# Vivado block design bd_4bfa, xcu50-fsvh2104-2-e, Vivado 2022.1
# (continued, part 2 of 3)
current_bd_instance /m01_nodes

# ---- hierarchy /m01_exit_pipeline ----
current_bd_instance /m01_exit_pipeline
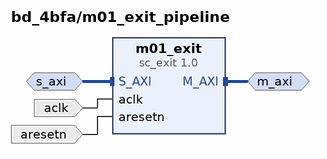
[diagram p8: block diagram inside /m01_exit_pipeline]
create_bd_intf_pin -mode Slave -vlnv xilinx.com:interface:aximm_rtl:1.0 s_axi
create_bd_intf_pin -mode Master -vlnv xilinx.com:interface:aximm_rtl:1.0 m_axi
create_bd_pin -dir I -type clk aclk
create_bd_pin -dir I -type rst aresetn

create_bd_cell -type ip -vlnv xilinx.com:ip:sc_exit:1.0 m01_exit
set_property -dict [list \
  CONFIG.ADDR_WIDTH 38 \
  CONFIG.HAS_BURST 1 \
  CONFIG.IS_CASCADED 1 \
  CONFIG.MAX_RUSER_BITS_PER_BYTE 0 \
  CONFIG.MAX_WUSER_BITS_PER_BYTE 0 \
  CONFIG.MEP_IDENTIFIER_WIDTH 1 \
  CONFIG.M_ARUSER_WIDTH 114 \
  CONFIG.M_AWUSER_WIDTH 114 \
  CONFIG.M_BUSER_WIDTH 114 \
  CONFIG.M_MAX_BURST_LENGTH 16 \
  CONFIG.M_RUSER_BITS_PER_BYTE 0 \
  CONFIG.M_RUSER_WIDTH 14 \
  CONFIG.M_WUSER_BITS_PER_BYTE 0 \
  CONFIG.M_WUSER_WIDTH 14 \
  CONFIG.NUM_MSC 5 \
  CONFIG.NUM_READ_OUTSTANDING 2 \
  CONFIG.NUM_WRITE_OUTSTANDING 2 \
  CONFIG.RDATA_WIDTH 512 \
  CONFIG.READ_WRITE_MODE READ_WRITE \
  CONFIG.SSC000_ROUTE 0b0 \
  CONFIG.SSC001_ROUTE 0b1 \
  CONFIG.SSC_ROUTE_WIDTH 1 \
  CONFIG.S_ID_WIDTH 1 \
  CONFIG.WDATA_WIDTH 512 \
] [get_bd_cells m01_exit]

# ---- hierarchy /m02_nodes ----
current_bd_instance /m02_nodes
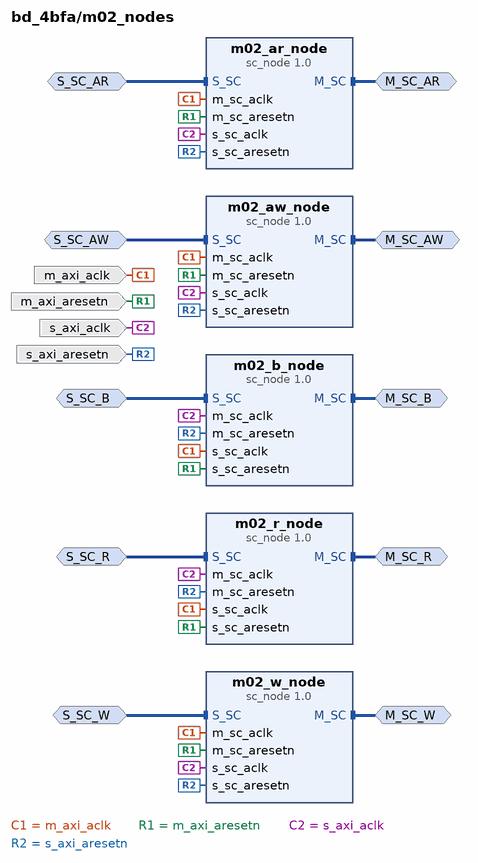
[diagram p9: block diagram inside /m02_nodes]
create_bd_intf_pin -mode Master -vlnv xilinx.com:interface:sc_rtl:1.0 M_SC_AR
create_bd_intf_pin -mode Slave -vlnv xilinx.com:interface:sc_rtl:1.0 S_SC_AR
create_bd_intf_pin -mode Master -vlnv xilinx.com:interface:sc_rtl:1.0 M_SC_R
create_bd_intf_pin -mode Slave -vlnv xilinx.com:interface:sc_rtl:1.0 S_SC_R
create_bd_intf_pin -mode Master -vlnv xilinx.com:interface:sc_rtl:1.0 M_SC_AW
create_bd_intf_pin -mode Slave -vlnv xilinx.com:interface:sc_rtl:1.0 S_SC_AW
create_bd_intf_pin -mode Master -vlnv xilinx.com:interface:sc_rtl:1.0 M_SC_W
create_bd_intf_pin -mode Slave -vlnv xilinx.com:interface:sc_rtl:1.0 S_SC_W
create_bd_intf_pin -mode Master -vlnv xilinx.com:interface:sc_rtl:1.0 M_SC_B
create_bd_intf_pin -mode Slave -vlnv xilinx.com:interface:sc_rtl:1.0 S_SC_B
create_bd_pin -dir I -type clk s_axi_aclk
create_bd_pin -dir I -type rst s_axi_aresetn
create_bd_pin -dir I -type clk m_axi_aclk
create_bd_pin -dir I -type rst m_axi_aresetn

create_bd_cell -type ip -vlnv xilinx.com:ip:sc_node:1.0 m02_ar_node
set_property -dict [list \
  CONFIG.ACLK_RELATIONSHIP 1 \
  CONFIG.ADDR_WIDTH 38 \
  CONFIG.CHANNEL 2 \
  CONFIG.ID_WIDTH 1 \
  CONFIG.M00_NUM_BYTES 64 \
  CONFIG.M01_NUM_BYTES 64 \
  CONFIG.M02_NUM_BYTES 64 \
  CONFIG.M03_NUM_BYTES 64 \
  CONFIG.M04_NUM_BYTES 64 \
  CONFIG.M05_NUM_BYTES 64 \
  CONFIG.M06_NUM_BYTES 64 \
  CONFIG.M07_NUM_BYTES 64 \
  CONFIG.M08_NUM_BYTES 64 \
  CONFIG.M09_NUM_BYTES 64 \
  CONFIG.M10_NUM_BYTES 64 \
  CONFIG.M11_NUM_BYTES 64 \
  CONFIG.M12_NUM_BYTES 64 \
  CONFIG.M13_NUM_BYTES 64 \
  CONFIG.M14_NUM_BYTES 64 \
  CONFIG.M15_NUM_BYTES 64 \
  CONFIG.MAX_PAYLD_BYTES 64 \
  CONFIG.M_SEND_PIPELINE 0 \
  CONFIG.NUM_MI 1 \
  CONFIG.NUM_OUTSTANDING 2 \
  CONFIG.NUM_SI 1 \
  CONFIG.PAYLD_WIDTH 148 \
  CONFIG.S00_NUM_BYTES 64 \
  CONFIG.S01_NUM_BYTES 64 \
  CONFIG.S02_NUM_BYTES 64 \
  CONFIG.S03_NUM_BYTES 64 \
  CONFIG.S04_NUM_BYTES 64 \
  CONFIG.S05_NUM_BYTES 64 \
  CONFIG.S06_NUM_BYTES 64 \
  CONFIG.S07_NUM_BYTES 64 \
  CONFIG.S08_NUM_BYTES 64 \
  CONFIG.S09_NUM_BYTES 64 \
  CONFIG.S10_NUM_BYTES 64 \
  CONFIG.S11_NUM_BYTES 64 \
  CONFIG.S12_NUM_BYTES 64 \
  CONFIG.S13_NUM_BYTES 64 \
  CONFIG.S14_NUM_BYTES 64 \
  CONFIG.S15_NUM_BYTES 64 \
  CONFIG.SC_ROUTE_WIDTH 5 \
  CONFIG.S_LATENCY 1 \
  CONFIG.S_PIPELINE 2 \
  CONFIG.USER_WIDTH 0 \
] [get_bd_cells m02_ar_node]
create_bd_cell -type ip -vlnv xilinx.com:ip:sc_node:1.0 m02_r_node
set_property -dict [list \
  CONFIG.ACLK_RELATIONSHIP 1 \
  CONFIG.ADDR_WIDTH 38 \
  CONFIG.CHANNEL 0 \
  CONFIG.ID_WIDTH 1 \
  CONFIG.M00_NUM_BYTES 64 \
  CONFIG.M01_NUM_BYTES 64 \
  CONFIG.M02_NUM_BYTES 64 \
  CONFIG.M03_NUM_BYTES 64 \
  CONFIG.M04_NUM_BYTES 64 \
  CONFIG.M05_NUM_BYTES 64 \
  CONFIG.M06_NUM_BYTES 64 \
  CONFIG.M07_NUM_BYTES 64 \
  CONFIG.M08_NUM_BYTES 64 \
  CONFIG.M09_NUM_BYTES 64 \
  CONFIG.M10_NUM_BYTES 64 \
  CONFIG.M11_NUM_BYTES 64 \
  CONFIG.M12_NUM_BYTES 64 \
  CONFIG.M13_NUM_BYTES 64 \
  CONFIG.M14_NUM_BYTES 64 \
  CONFIG.M15_NUM_BYTES 64 \
  CONFIG.MAX_PAYLD_BYTES 64 \
  CONFIG.M_PIPELINE 0 \
  CONFIG.NUM_MI 1 \
  CONFIG.NUM_OUTSTANDING 2 \
  CONFIG.NUM_SI 1 \
  CONFIG.PAYLD_WIDTH 531 \
  CONFIG.S00_NUM_BYTES 64 \
  CONFIG.S01_NUM_BYTES 64 \
  CONFIG.S02_NUM_BYTES 64 \
  CONFIG.S03_NUM_BYTES 64 \
  CONFIG.S04_NUM_BYTES 64 \
  CONFIG.S05_NUM_BYTES 64 \
  CONFIG.S06_NUM_BYTES 64 \
  CONFIG.S07_NUM_BYTES 64 \
  CONFIG.S08_NUM_BYTES 64 \
  CONFIG.S09_NUM_BYTES 64 \
  CONFIG.S10_NUM_BYTES 64 \
  CONFIG.S11_NUM_BYTES 64 \
  CONFIG.S12_NUM_BYTES 64 \
  CONFIG.S13_NUM_BYTES 64 \
  CONFIG.S14_NUM_BYTES 64 \
  CONFIG.S15_NUM_BYTES 64 \
  CONFIG.SC_ROUTE_WIDTH 1 \
  CONFIG.S_PIPELINE 2 \
  CONFIG.USER_BITS_PER_BYTE 0 \
  CONFIG.USER_WIDTH 0 \
] [get_bd_cells m02_r_node]
create_bd_cell -type ip -vlnv xilinx.com:ip:sc_node:1.0 m02_aw_node
set_property -dict [list \
  CONFIG.ACLK_RELATIONSHIP 1 \
  CONFIG.ADDR_WIDTH 38 \
  CONFIG.CHANNEL 3 \
  CONFIG.ID_WIDTH 1 \
  CONFIG.M00_NUM_BYTES 64 \
  CONFIG.M01_NUM_BYTES 64 \
  CONFIG.M02_NUM_BYTES 64 \
  CONFIG.M03_NUM_BYTES 64 \
  CONFIG.M04_NUM_BYTES 64 \
  CONFIG.M05_NUM_BYTES 64 \
  CONFIG.M06_NUM_BYTES 64 \
  CONFIG.M07_NUM_BYTES 64 \
  CONFIG.M08_NUM_BYTES 64 \
  CONFIG.M09_NUM_BYTES 64 \
  CONFIG.M10_NUM_BYTES 64 \
  CONFIG.M11_NUM_BYTES 64 \
  CONFIG.M12_NUM_BYTES 64 \
  CONFIG.M13_NUM_BYTES 64 \
  CONFIG.M14_NUM_BYTES 64 \
  CONFIG.M15_NUM_BYTES 64 \
  CONFIG.MAX_PAYLD_BYTES 64 \
  CONFIG.M_SEND_PIPELINE 0 \
  CONFIG.NUM_MI 1 \
  CONFIG.NUM_OUTSTANDING 2 \
  CONFIG.NUM_SI 1 \
  CONFIG.PAYLD_WIDTH 148 \
  CONFIG.S00_NUM_BYTES 64 \
  CONFIG.S01_NUM_BYTES 64 \
  CONFIG.S02_NUM_BYTES 64 \
  CONFIG.S03_NUM_BYTES 64 \
  CONFIG.S04_NUM_BYTES 64 \
  CONFIG.S05_NUM_BYTES 64 \
  CONFIG.S06_NUM_BYTES 64 \
  CONFIG.S07_NUM_BYTES 64 \
  CONFIG.S08_NUM_BYTES 64 \
  CONFIG.S09_NUM_BYTES 64 \
  CONFIG.S10_NUM_BYTES 64 \
  CONFIG.S11_NUM_BYTES 64 \
  CONFIG.S12_NUM_BYTES 64 \
  CONFIG.S13_NUM_BYTES 64 \
  CONFIG.S14_NUM_BYTES 64 \
  CONFIG.S15_NUM_BYTES 64 \
  CONFIG.SC_ROUTE_WIDTH 5 \
  CONFIG.S_LATENCY 1 \
  CONFIG.S_PIPELINE 2 \
  CONFIG.USER_WIDTH 0 \
] [get_bd_cells m02_aw_node]
create_bd_cell -type ip -vlnv xilinx.com:ip:sc_node:1.0 m02_w_node
set_property -dict [list \
  CONFIG.ACLK_RELATIONSHIP 1 \
  CONFIG.ADDR_WIDTH 38 \
  CONFIG.CHANNEL 1 \
  CONFIG.ID_WIDTH 1 \
  CONFIG.M00_NUM_BYTES 64 \
  CONFIG.M01_NUM_BYTES 64 \
  CONFIG.M02_NUM_BYTES 64 \
  CONFIG.M03_NUM_BYTES 64 \
  CONFIG.M04_NUM_BYTES 64 \
  CONFIG.M05_NUM_BYTES 64 \
  CONFIG.M06_NUM_BYTES 64 \
  CONFIG.M07_NUM_BYTES 64 \
  CONFIG.M08_NUM_BYTES 64 \
  CONFIG.M09_NUM_BYTES 64 \
  CONFIG.M10_NUM_BYTES 64 \
  CONFIG.M11_NUM_BYTES 64 \
  CONFIG.M12_NUM_BYTES 64 \
  CONFIG.M13_NUM_BYTES 64 \
  CONFIG.M14_NUM_BYTES 64 \
  CONFIG.M15_NUM_BYTES 64 \
  CONFIG.MAX_PAYLD_BYTES 64 \
  CONFIG.M_SEND_PIPELINE 0 \
  CONFIG.NUM_MI 1 \
  CONFIG.NUM_OUTSTANDING 2 \
  CONFIG.NUM_SI 1 \
  CONFIG.PAYLD_WIDTH 596 \
  CONFIG.S00_NUM_BYTES 64 \
  CONFIG.S01_NUM_BYTES 64 \
  CONFIG.S02_NUM_BYTES 64 \
  CONFIG.S03_NUM_BYTES 64 \
  CONFIG.S04_NUM_BYTES 64 \
  CONFIG.S05_NUM_BYTES 64 \
  CONFIG.S06_NUM_BYTES 64 \
  CONFIG.S07_NUM_BYTES 64 \
  CONFIG.S08_NUM_BYTES 64 \
  CONFIG.S09_NUM_BYTES 64 \
  CONFIG.S10_NUM_BYTES 64 \
  CONFIG.S11_NUM_BYTES 64 \
  CONFIG.S12_NUM_BYTES 64 \
  CONFIG.S13_NUM_BYTES 64 \
  CONFIG.S14_NUM_BYTES 64 \
  CONFIG.S15_NUM_BYTES 64 \
  CONFIG.SC_ROUTE_WIDTH 5 \
  CONFIG.S_LATENCY 1 \
  CONFIG.S_PIPELINE 2 \
  CONFIG.USER_BITS_PER_BYTE 0 \
  CONFIG.USER_WIDTH 0 \
] [get_bd_cells m02_w_node]
create_bd_cell -type ip -vlnv xilinx.com:ip:sc_node:1.0 m02_b_node
set_property -dict [list \
  CONFIG.ACLK_RELATIONSHIP 1 \
  CONFIG.ADDR_WIDTH 38 \
  CONFIG.CHANNEL 4 \
  CONFIG.ID_WIDTH 1 \
  CONFIG.M00_NUM_BYTES 64 \
  CONFIG.M01_NUM_BYTES 64 \
  CONFIG.M02_NUM_BYTES 64 \
  CONFIG.M03_NUM_BYTES 64 \
  CONFIG.M04_NUM_BYTES 64 \
  CONFIG.M05_NUM_BYTES 64 \
  CONFIG.M06_NUM_BYTES 64 \
  CONFIG.M07_NUM_BYTES 64 \
  CONFIG.M08_NUM_BYTES 64 \
  CONFIG.M09_NUM_BYTES 64 \
  CONFIG.M10_NUM_BYTES 64 \
  CONFIG.M11_NUM_BYTES 64 \
  CONFIG.M12_NUM_BYTES 64 \
  CONFIG.M13_NUM_BYTES 64 \
  CONFIG.M14_NUM_BYTES 64 \
  CONFIG.M15_NUM_BYTES 64 \
  CONFIG.MAX_PAYLD_BYTES 64 \
  CONFIG.M_PIPELINE 0 \
  CONFIG.NUM_MI 1 \
  CONFIG.NUM_OUTSTANDING 2 \
  CONFIG.NUM_SI 1 \
  CONFIG.PAYLD_WIDTH 5 \
  CONFIG.S00_NUM_BYTES 64 \
  CONFIG.S01_NUM_BYTES 64 \
  CONFIG.S02_NUM_BYTES 64 \
  CONFIG.S03_NUM_BYTES 64 \
  CONFIG.S04_NUM_BYTES 64 \
  CONFIG.S05_NUM_BYTES 64 \
  CONFIG.S06_NUM_BYTES 64 \
  CONFIG.S07_NUM_BYTES 64 \
  CONFIG.S08_NUM_BYTES 64 \
  CONFIG.S09_NUM_BYTES 64 \
  CONFIG.S10_NUM_BYTES 64 \
  CONFIG.S11_NUM_BYTES 64 \
  CONFIG.S12_NUM_BYTES 64 \
  CONFIG.S13_NUM_BYTES 64 \
  CONFIG.S14_NUM_BYTES 64 \
  CONFIG.S15_NUM_BYTES 64 \
  CONFIG.SC_ROUTE_WIDTH 1 \
  CONFIG.S_PIPELINE 2 \
  CONFIG.USER_WIDTH 0 \
] [get_bd_cells m02_b_node]

# ---- hierarchy /m02_exit_pipeline ----
current_bd_instance /m02_exit_pipeline
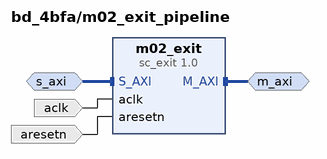
[diagram p10: block diagram inside /m02_exit_pipeline]
create_bd_intf_pin -mode Slave -vlnv xilinx.com:interface:aximm_rtl:1.0 s_axi
create_bd_intf_pin -mode Master -vlnv xilinx.com:interface:aximm_rtl:1.0 m_axi
create_bd_pin -dir I -type clk aclk
create_bd_pin -dir I -type rst aresetn

create_bd_cell -type ip -vlnv xilinx.com:ip:sc_exit:1.0 m02_exit
set_property -dict [list \
  CONFIG.ADDR_WIDTH 38 \
  CONFIG.HAS_BURST 1 \
  CONFIG.IS_CASCADED 1 \
  CONFIG.MAX_RUSER_BITS_PER_BYTE 0 \
  CONFIG.MAX_WUSER_BITS_PER_BYTE 0 \
  CONFIG.MEP_IDENTIFIER_WIDTH 1 \
  CONFIG.M_ARUSER_WIDTH 114 \
  CONFIG.M_AWUSER_WIDTH 114 \
  CONFIG.M_BUSER_WIDTH 114 \
  CONFIG.M_MAX_BURST_LENGTH 16 \
  CONFIG.M_RUSER_BITS_PER_BYTE 0 \
  CONFIG.M_RUSER_WIDTH 14 \
  CONFIG.M_WUSER_BITS_PER_BYTE 0 \
  CONFIG.M_WUSER_WIDTH 14 \
  CONFIG.NUM_MSC 5 \
  CONFIG.NUM_READ_OUTSTANDING 2 \
  CONFIG.NUM_WRITE_OUTSTANDING 2 \
  CONFIG.RDATA_WIDTH 512 \
  CONFIG.READ_WRITE_MODE READ_WRITE \
  CONFIG.SSC000_ROUTE 0b0 \
  CONFIG.SSC001_ROUTE 0b1 \
  CONFIG.SSC_ROUTE_WIDTH 1 \
  CONFIG.S_ID_WIDTH 1 \
  CONFIG.WDATA_WIDTH 512 \
] [get_bd_cells m02_exit]

# ---- hierarchy /m03_nodes ----
current_bd_instance /m03_nodes
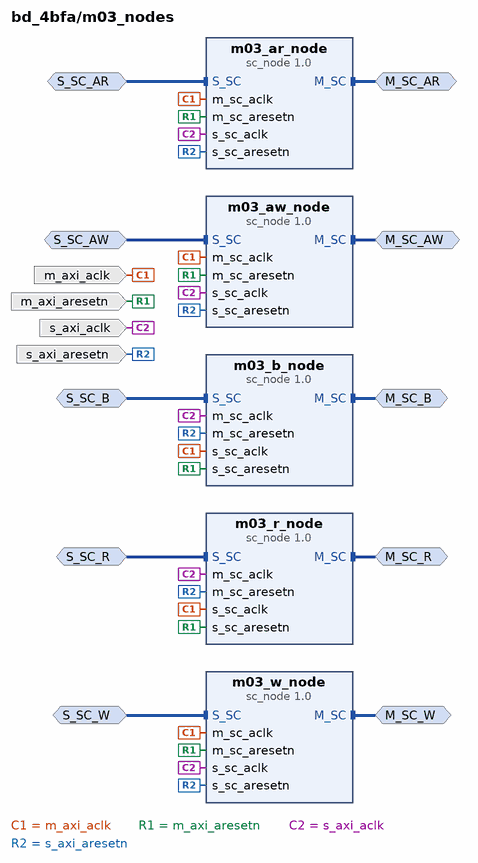
[diagram p11: block diagram inside /m03_nodes]
create_bd_intf_pin -mode Master -vlnv xilinx.com:interface:sc_rtl:1.0 M_SC_AR
create_bd_intf_pin -mode Slave -vlnv xilinx.com:interface:sc_rtl:1.0 S_SC_AR
create_bd_intf_pin -mode Master -vlnv xilinx.com:interface:sc_rtl:1.0 M_SC_R
create_bd_intf_pin -mode Slave -vlnv xilinx.com:interface:sc_rtl:1.0 S_SC_R
create_bd_intf_pin -mode Master -vlnv xilinx.com:interface:sc_rtl:1.0 M_SC_AW
create_bd_intf_pin -mode Slave -vlnv xilinx.com:interface:sc_rtl:1.0 S_SC_AW
create_bd_intf_pin -mode Master -vlnv xilinx.com:interface:sc_rtl:1.0 M_SC_W
create_bd_intf_pin -mode Slave -vlnv xilinx.com:interface:sc_rtl:1.0 S_SC_W
create_bd_intf_pin -mode Master -vlnv xilinx.com:interface:sc_rtl:1.0 M_SC_B
create_bd_intf_pin -mode Slave -vlnv xilinx.com:interface:sc_rtl:1.0 S_SC_B
create_bd_pin -dir I -type clk s_axi_aclk
create_bd_pin -dir I -type rst s_axi_aresetn
create_bd_pin -dir I -type clk m_axi_aclk
create_bd_pin -dir I -type rst m_axi_aresetn

create_bd_cell -type ip -vlnv xilinx.com:ip:sc_node:1.0 m03_ar_node
set_property -dict [list \
  CONFIG.ACLK_RELATIONSHIP 1 \
  CONFIG.ADDR_WIDTH 38 \
  CONFIG.CHANNEL 2 \
  CONFIG.ID_WIDTH 1 \
  CONFIG.M00_NUM_BYTES 64 \
  CONFIG.M01_NUM_BYTES 64 \
  CONFIG.M02_NUM_BYTES 64 \
  CONFIG.M03_NUM_BYTES 64 \
  CONFIG.M04_NUM_BYTES 64 \
  CONFIG.M05_NUM_BYTES 64 \
  CONFIG.M06_NUM_BYTES 64 \
  CONFIG.M07_NUM_BYTES 64 \
  CONFIG.M08_NUM_BYTES 64 \
  CONFIG.M09_NUM_BYTES 64 \
  CONFIG.M10_NUM_BYTES 64 \
  CONFIG.M11_NUM_BYTES 64 \
  CONFIG.M12_NUM_BYTES 64 \
  CONFIG.M13_NUM_BYTES 64 \
  CONFIG.M14_NUM_BYTES 64 \
  CONFIG.M15_NUM_BYTES 64 \
  CONFIG.MAX_PAYLD_BYTES 64 \
  CONFIG.M_SEND_PIPELINE 0 \
  CONFIG.NUM_MI 1 \
  CONFIG.NUM_OUTSTANDING 2 \
  CONFIG.NUM_SI 1 \
  CONFIG.PAYLD_WIDTH 148 \
  CONFIG.S00_NUM_BYTES 64 \
  CONFIG.S01_NUM_BYTES 64 \
  CONFIG.S02_NUM_BYTES 64 \
  CONFIG.S03_NUM_BYTES 64 \
  CONFIG.S04_NUM_BYTES 64 \
  CONFIG.S05_NUM_BYTES 64 \
  CONFIG.S06_NUM_BYTES 64 \
  CONFIG.S07_NUM_BYTES 64 \
  CONFIG.S08_NUM_BYTES 64 \
  CONFIG.S09_NUM_BYTES 64 \
  CONFIG.S10_NUM_BYTES 64 \
  CONFIG.S11_NUM_BYTES 64 \
  CONFIG.S12_NUM_BYTES 64 \
  CONFIG.S13_NUM_BYTES 64 \
  CONFIG.S14_NUM_BYTES 64 \
  CONFIG.S15_NUM_BYTES 64 \
  CONFIG.SC_ROUTE_WIDTH 5 \
  CONFIG.S_LATENCY 1 \
  CONFIG.USER_WIDTH 0 \
] [get_bd_cells m03_ar_node]
create_bd_cell -type ip -vlnv xilinx.com:ip:sc_node:1.0 m03_r_node
set_property -dict [list \
  CONFIG.ACLK_RELATIONSHIP 1 \
  CONFIG.ADDR_WIDTH 38 \
  CONFIG.CHANNEL 0 \
  CONFIG.ID_WIDTH 1 \
  CONFIG.M00_NUM_BYTES 64 \
  CONFIG.M01_NUM_BYTES 64 \
  CONFIG.M02_NUM_BYTES 64 \
  CONFIG.M03_NUM_BYTES 64 \
  CONFIG.M04_NUM_BYTES 64 \
  CONFIG.M05_NUM_BYTES 64 \
  CONFIG.M06_NUM_BYTES 64 \
  CONFIG.M07_NUM_BYTES 64 \
  CONFIG.M08_NUM_BYTES 64 \
  CONFIG.M09_NUM_BYTES 64 \
  CONFIG.M10_NUM_BYTES 64 \
  CONFIG.M11_NUM_BYTES 64 \
  CONFIG.M12_NUM_BYTES 64 \
  CONFIG.M13_NUM_BYTES 64 \
  CONFIG.M14_NUM_BYTES 64 \
  CONFIG.M15_NUM_BYTES 64 \
  CONFIG.MAX_PAYLD_BYTES 64 \
  CONFIG.M_PIPELINE 0 \
  CONFIG.NUM_MI 1 \
  CONFIG.NUM_OUTSTANDING 2 \
  CONFIG.NUM_SI 1 \
  CONFIG.PAYLD_WIDTH 531 \
  CONFIG.S00_NUM_BYTES 64 \
  CONFIG.S01_NUM_BYTES 64 \
  CONFIG.S02_NUM_BYTES 64 \
  CONFIG.S03_NUM_BYTES 64 \
  CONFIG.S04_NUM_BYTES 64 \
  CONFIG.S05_NUM_BYTES 64 \
  CONFIG.S06_NUM_BYTES 64 \
  CONFIG.S07_NUM_BYTES 64 \
  CONFIG.S08_NUM_BYTES 64 \
  CONFIG.S09_NUM_BYTES 64 \
  CONFIG.S10_NUM_BYTES 64 \
  CONFIG.S11_NUM_BYTES 64 \
  CONFIG.S12_NUM_BYTES 64 \
  CONFIG.S13_NUM_BYTES 64 \
  CONFIG.S14_NUM_BYTES 64 \
  CONFIG.S15_NUM_BYTES 64 \
  CONFIG.SC_ROUTE_WIDTH 1 \
  CONFIG.USER_BITS_PER_BYTE 0 \
  CONFIG.USER_WIDTH 0 \
] [get_bd_cells m03_r_node]
create_bd_cell -type ip -vlnv xilinx.com:ip:sc_node:1.0 m03_aw_node
set_property -dict [list \
  CONFIG.ACLK_RELATIONSHIP 1 \
  CONFIG.ADDR_WIDTH 38 \
  CONFIG.CHANNEL 3 \
  CONFIG.ID_WIDTH 1 \
  CONFIG.M00_NUM_BYTES 64 \
  CONFIG.M01_NUM_BYTES 64 \
  CONFIG.M02_NUM_BYTES 64 \
  CONFIG.M03_NUM_BYTES 64 \
  CONFIG.M04_NUM_BYTES 64 \
  CONFIG.M05_NUM_BYTES 64 \
  CONFIG.M06_NUM_BYTES 64 \
  CONFIG.M07_NUM_BYTES 64 \
  CONFIG.M08_NUM_BYTES 64 \
  CONFIG.M09_NUM_BYTES 64 \
  CONFIG.M10_NUM_BYTES 64 \
  CONFIG.M11_NUM_BYTES 64 \
  CONFIG.M12_NUM_BYTES 64 \
  CONFIG.M13_NUM_BYTES 64 \
  CONFIG.M14_NUM_BYTES 64 \
  CONFIG.M15_NUM_BYTES 64 \
  CONFIG.MAX_PAYLD_BYTES 64 \
  CONFIG.M_SEND_PIPELINE 0 \
  CONFIG.NUM_MI 1 \
  CONFIG.NUM_OUTSTANDING 2 \
  CONFIG.NUM_SI 1 \
  CONFIG.PAYLD_WIDTH 148 \
  CONFIG.S00_NUM_BYTES 64 \
  CONFIG.S01_NUM_BYTES 64 \
  CONFIG.S02_NUM_BYTES 64 \
  CONFIG.S03_NUM_BYTES 64 \
  CONFIG.S04_NUM_BYTES 64 \
  CONFIG.S05_NUM_BYTES 64 \
  CONFIG.S06_NUM_BYTES 64 \
  CONFIG.S07_NUM_BYTES 64 \
  CONFIG.S08_NUM_BYTES 64 \
  CONFIG.S09_NUM_BYTES 64 \
  CONFIG.S10_NUM_BYTES 64 \
  CONFIG.S11_NUM_BYTES 64 \
  CONFIG.S12_NUM_BYTES 64 \
  CONFIG.S13_NUM_BYTES 64 \
  CONFIG.S14_NUM_BYTES 64 \
  CONFIG.S15_NUM_BYTES 64 \
  CONFIG.SC_ROUTE_WIDTH 5 \
  CONFIG.S_LATENCY 1 \
  CONFIG.USER_WIDTH 0 \
] [get_bd_cells m03_aw_node]
create_bd_cell -type ip -vlnv xilinx.com:ip:sc_node:1.0 m03_w_node
set_property -dict [list \
  CONFIG.ACLK_RELATIONSHIP 1 \
  CONFIG.ADDR_WIDTH 38 \
  CONFIG.CHANNEL 1 \
  CONFIG.ID_WIDTH 1 \
  CONFIG.M00_NUM_BYTES 64 \
  CONFIG.M01_NUM_BYTES 64 \
  CONFIG.M02_NUM_BYTES 64 \
  CONFIG.M03_NUM_BYTES 64 \
  CONFIG.M04_NUM_BYTES 64 \
  CONFIG.M05_NUM_BYTES 64 \
  CONFIG.M06_NUM_BYTES 64 \
  CONFIG.M07_NUM_BYTES 64 \
  CONFIG.M08_NUM_BYTES 64 \
  CONFIG.M09_NUM_BYTES 64 \
  CONFIG.M10_NUM_BYTES 64 \
  CONFIG.M11_NUM_BYTES 64 \
  CONFIG.M12_NUM_BYTES 64 \
  CONFIG.M13_NUM_BYTES 64 \
  CONFIG.M14_NUM_BYTES 64 \
  CONFIG.M15_NUM_BYTES 64 \
  CONFIG.MAX_PAYLD_BYTES 64 \
  CONFIG.M_SEND_PIPELINE 0 \
  CONFIG.NUM_MI 1 \
  CONFIG.NUM_OUTSTANDING 2 \
  CONFIG.NUM_SI 1 \
  CONFIG.PAYLD_WIDTH 596 \
  CONFIG.S00_NUM_BYTES 64 \
  CONFIG.S01_NUM_BYTES 64 \
  CONFIG.S02_NUM_BYTES 64 \
  CONFIG.S03_NUM_BYTES 64 \
  CONFIG.S04_NUM_BYTES 64 \
  CONFIG.S05_NUM_BYTES 64 \
  CONFIG.S06_NUM_BYTES 64 \
  CONFIG.S07_NUM_BYTES 64 \
  CONFIG.S08_NUM_BYTES 64 \
  CONFIG.S09_NUM_BYTES 64 \
  CONFIG.S10_NUM_BYTES 64 \
  CONFIG.S11_NUM_BYTES 64 \
  CONFIG.S12_NUM_BYTES 64 \
  CONFIG.S13_NUM_BYTES 64 \
  CONFIG.S14_NUM_BYTES 64 \
  CONFIG.S15_NUM_BYTES 64 \
  CONFIG.SC_ROUTE_WIDTH 5 \
  CONFIG.S_LATENCY 1 \
  CONFIG.USER_BITS_PER_BYTE 0 \
  CONFIG.USER_WIDTH 0 \
] [get_bd_cells m03_w_node]
create_bd_cell -type ip -vlnv xilinx.com:ip:sc_node:1.0 m03_b_node
set_property -dict [list \
  CONFIG.ACLK_RELATIONSHIP 1 \
  CONFIG.ADDR_WIDTH 38 \
  CONFIG.CHANNEL 4 \
  CONFIG.ID_WIDTH 1 \
  CONFIG.M00_NUM_BYTES 64 \
  CONFIG.M01_NUM_BYTES 64 \
  CONFIG.M02_NUM_BYTES 64 \
  CONFIG.M03_NUM_BYTES 64 \
  CONFIG.M04_NUM_BYTES 64 \
  CONFIG.M05_NUM_BYTES 64 \
  CONFIG.M06_NUM_BYTES 64 \
  CONFIG.M07_NUM_BYTES 64 \
  CONFIG.M08_NUM_BYTES 64 \
  CONFIG.M09_NUM_BYTES 64 \
  CONFIG.M10_NUM_BYTES 64 \
  CONFIG.M11_NUM_BYTES 64 \
  CONFIG.M12_NUM_BYTES 64 \
  CONFIG.M13_NUM_BYTES 64 \
  CONFIG.M14_NUM_BYTES 64 \
  CONFIG.M15_NUM_BYTES 64 \
  CONFIG.MAX_PAYLD_BYTES 64 \
  CONFIG.M_PIPELINE 0 \
  CONFIG.NUM_MI 1 \
  CONFIG.NUM_OUTSTANDING 2 \
  CONFIG.NUM_SI 1 \
  CONFIG.PAYLD_WIDTH 5 \
  CONFIG.S00_NUM_BYTES 64 \
  CONFIG.S01_NUM_BYTES 64 \
  CONFIG.S02_NUM_BYTES 64 \
  CONFIG.S03_NUM_BYTES 64 \
  CONFIG.S04_NUM_BYTES 64 \
  CONFIG.S05_NUM_BYTES 64 \
  CONFIG.S06_NUM_BYTES 64 \
  CONFIG.S07_NUM_BYTES 64 \
  CONFIG.S08_NUM_BYTES 64 \
  CONFIG.S09_NUM_BYTES 64 \
  CONFIG.S10_NUM_BYTES 64 \
  CONFIG.S11_NUM_BYTES 64 \
  CONFIG.S12_NUM_BYTES 64 \
  CONFIG.S13_NUM_BYTES 64 \
  CONFIG.S14_NUM_BYTES 64 \
  CONFIG.S15_NUM_BYTES 64 \
  CONFIG.SC_ROUTE_WIDTH 1 \
  CONFIG.USER_WIDTH 0 \
] [get_bd_cells m03_b_node]

# ---- hierarchy /m03_exit_pipeline ----
current_bd_instance /m03_exit_pipeline
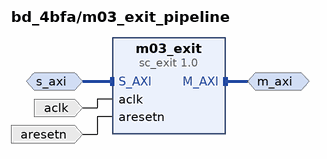
[diagram p12: block diagram inside /m03_exit_pipeline]
create_bd_intf_pin -mode Slave -vlnv xilinx.com:interface:aximm_rtl:1.0 s_axi
create_bd_intf_pin -mode Master -vlnv xilinx.com:interface:aximm_rtl:1.0 m_axi
create_bd_pin -dir I -type clk aclk
create_bd_pin -dir I -type rst aresetn

create_bd_cell -type ip -vlnv xilinx.com:ip:sc_exit:1.0 m03_exit
set_property -dict [list \
  CONFIG.ADDR_WIDTH 38 \
  CONFIG.HAS_BURST 1 \
  CONFIG.IS_CASCADED 1 \
  CONFIG.MAX_RUSER_BITS_PER_BYTE 0 \
  CONFIG.MAX_WUSER_BITS_PER_BYTE 0 \
  CONFIG.MEP_IDENTIFIER_WIDTH 1 \
  CONFIG.M_ARUSER_WIDTH 114 \
  CONFIG.M_AWUSER_WIDTH 114 \
  CONFIG.M_BUSER_WIDTH 114 \
  CONFIG.M_MAX_BURST_LENGTH 16 \
  CONFIG.M_RUSER_BITS_PER_BYTE 0 \
  CONFIG.M_RUSER_WIDTH 14 \
  CONFIG.M_WUSER_BITS_PER_BYTE 0 \
  CONFIG.M_WUSER_WIDTH 14 \
  CONFIG.NUM_MSC 5 \
  CONFIG.NUM_READ_OUTSTANDING 2 \
  CONFIG.NUM_WRITE_OUTSTANDING 2 \
  CONFIG.RDATA_WIDTH 512 \
  CONFIG.READ_WRITE_MODE READ_WRITE \
  CONFIG.SSC000_ROUTE 0b0 \
  CONFIG.SSC001_ROUTE 0b1 \
  CONFIG.SSC_ROUTE_WIDTH 1 \
  CONFIG.S_ID_WIDTH 1 \
  CONFIG.WDATA_WIDTH 512 \
] [get_bd_cells m03_exit]

# ---- hierarchy /m04_nodes ----
current_bd_instance /m04_nodes
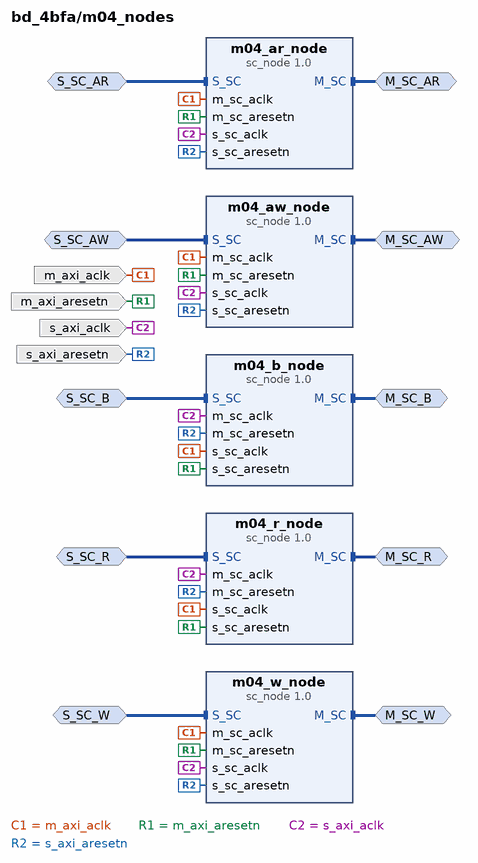
[diagram p13: block diagram inside /m04_nodes]
create_bd_intf_pin -mode Master -vlnv xilinx.com:interface:sc_rtl:1.0 M_SC_AR
create_bd_intf_pin -mode Slave -vlnv xilinx.com:interface:sc_rtl:1.0 S_SC_AR
create_bd_intf_pin -mode Master -vlnv xilinx.com:interface:sc_rtl:1.0 M_SC_R
create_bd_intf_pin -mode Slave -vlnv xilinx.com:interface:sc_rtl:1.0 S_SC_R
create_bd_intf_pin -mode Master -vlnv xilinx.com:interface:sc_rtl:1.0 M_SC_AW
create_bd_intf_pin -mode Slave -vlnv xilinx.com:interface:sc_rtl:1.0 S_SC_AW
create_bd_intf_pin -mode Master -vlnv xilinx.com:interface:sc_rtl:1.0 M_SC_W
create_bd_intf_pin -mode Slave -vlnv xilinx.com:interface:sc_rtl:1.0 S_SC_W
create_bd_intf_pin -mode Master -vlnv xilinx.com:interface:sc_rtl:1.0 M_SC_B
create_bd_intf_pin -mode Slave -vlnv xilinx.com:interface:sc_rtl:1.0 S_SC_B
create_bd_pin -dir I -type clk s_axi_aclk
create_bd_pin -dir I -type rst s_axi_aresetn
create_bd_pin -dir I -type clk m_axi_aclk
create_bd_pin -dir I -type rst m_axi_aresetn

create_bd_cell -type ip -vlnv xilinx.com:ip:sc_node:1.0 m04_ar_node
set_property -dict [list \
  CONFIG.ACLK_RELATIONSHIP 1 \
  CONFIG.ADDR_WIDTH 38 \
  CONFIG.CHANNEL 2 \
  CONFIG.ID_WIDTH 1 \
  CONFIG.M00_NUM_BYTES 64 \
  CONFIG.M01_NUM_BYTES 64 \
  CONFIG.M02_NUM_BYTES 64 \
  CONFIG.M03_NUM_BYTES 64 \
  CONFIG.M04_NUM_BYTES 64 \
  CONFIG.M05_NUM_BYTES 64 \
  CONFIG.M06_NUM_BYTES 64 \
  CONFIG.M07_NUM_BYTES 64 \
  CONFIG.M08_NUM_BYTES 64 \
  CONFIG.M09_NUM_BYTES 64 \
  CONFIG.M10_NUM_BYTES 64 \
  CONFIG.M11_NUM_BYTES 64 \
  CONFIG.M12_NUM_BYTES 64 \
  CONFIG.M13_NUM_BYTES 64 \
  CONFIG.M14_NUM_BYTES 64 \
  CONFIG.M15_NUM_BYTES 64 \
  CONFIG.MAX_PAYLD_BYTES 64 \
  CONFIG.M_SEND_PIPELINE 0 \
  CONFIG.NUM_MI 1 \
  CONFIG.NUM_OUTSTANDING 2 \
  CONFIG.NUM_SI 1 \
  CONFIG.PAYLD_WIDTH 148 \
  CONFIG.S00_NUM_BYTES 64 \
  CONFIG.S01_NUM_BYTES 64 \
  CONFIG.S02_NUM_BYTES 64 \
  CONFIG.S03_NUM_BYTES 64 \
  CONFIG.S04_NUM_BYTES 64 \
  CONFIG.S05_NUM_BYTES 64 \
  CONFIG.S06_NUM_BYTES 64 \
  CONFIG.S07_NUM_BYTES 64 \
  CONFIG.S08_NUM_BYTES 64 \
  CONFIG.S09_NUM_BYTES 64 \
  CONFIG.S10_NUM_BYTES 64 \
  CONFIG.S11_NUM_BYTES 64 \
  CONFIG.S12_NUM_BYTES 64 \
  CONFIG.S13_NUM_BYTES 64 \
  CONFIG.S14_NUM_BYTES 64 \
  CONFIG.S15_NUM_BYTES 64 \
  CONFIG.SC_ROUTE_WIDTH 5 \
  CONFIG.S_LATENCY 1 \
  CONFIG.USER_WIDTH 0 \
] [get_bd_cells m04_ar_node]
create_bd_cell -type ip -vlnv xilinx.com:ip:sc_node:1.0 m04_r_node
set_property -dict [list \
  CONFIG.ACLK_RELATIONSHIP 1 \
  CONFIG.ADDR_WIDTH 38 \
  CONFIG.CHANNEL 0 \
  CONFIG.ID_WIDTH 1 \
  CONFIG.M00_NUM_BYTES 64 \
  CONFIG.M01_NUM_BYTES 64 \
  CONFIG.M02_NUM_BYTES 64 \
  CONFIG.M03_NUM_BYTES 64 \
  CONFIG.M04_NUM_BYTES 64 \
  CONFIG.M05_NUM_BYTES 64 \
  CONFIG.M06_NUM_BYTES 64 \
  CONFIG.M07_NUM_BYTES 64 \
  CONFIG.M08_NUM_BYTES 64 \
  CONFIG.M09_NUM_BYTES 64 \
  CONFIG.M10_NUM_BYTES 64 \
  CONFIG.M11_NUM_BYTES 64 \
  CONFIG.M12_NUM_BYTES 64 \
  CONFIG.M13_NUM_BYTES 64 \
  CONFIG.M14_NUM_BYTES 64 \
  CONFIG.M15_NUM_BYTES 64 \
  CONFIG.MAX_PAYLD_BYTES 64 \
  CONFIG.M_PIPELINE 0 \
  CONFIG.NUM_MI 1 \
  CONFIG.NUM_OUTSTANDING 2 \
  CONFIG.NUM_SI 1 \
  CONFIG.PAYLD_WIDTH 531 \
  CONFIG.S00_NUM_BYTES 64 \
  CONFIG.S01_NUM_BYTES 64 \
  CONFIG.S02_NUM_BYTES 64 \
  CONFIG.S03_NUM_BYTES 64 \
  CONFIG.S04_NUM_BYTES 64 \
  CONFIG.S05_NUM_BYTES 64 \
  CONFIG.S06_NUM_BYTES 64 \
  CONFIG.S07_NUM_BYTES 64 \
  CONFIG.S08_NUM_BYTES 64 \
  CONFIG.S09_NUM_BYTES 64 \
  CONFIG.S10_NUM_BYTES 64 \
  CONFIG.S11_NUM_BYTES 64 \
  CONFIG.S12_NUM_BYTES 64 \
  CONFIG.S13_NUM_BYTES 64 \
  CONFIG.S14_NUM_BYTES 64 \
  CONFIG.S15_NUM_BYTES 64 \
  CONFIG.SC_ROUTE_WIDTH 1 \
  CONFIG.USER_BITS_PER_BYTE 0 \
  CONFIG.USER_WIDTH 0 \
] [get_bd_cells m04_r_node]
create_bd_cell -type ip -vlnv xilinx.com:ip:sc_node:1.0 m04_aw_node
set_property -dict [list \
  CONFIG.ACLK_RELATIONSHIP 1 \
  CONFIG.ADDR_WIDTH 38 \
  CONFIG.CHANNEL 3 \
  CONFIG.ID_WIDTH 1 \
  CONFIG.M00_NUM_BYTES 64 \
  CONFIG.M01_NUM_BYTES 64 \
  CONFIG.M02_NUM_BYTES 64 \
  CONFIG.M03_NUM_BYTES 64 \
  CONFIG.M04_NUM_BYTES 64 \
  CONFIG.M05_NUM_BYTES 64 \
  CONFIG.M06_NUM_BYTES 64 \
  CONFIG.M07_NUM_BYTES 64 \
  CONFIG.M08_NUM_BYTES 64 \
  CONFIG.M09_NUM_BYTES 64 \
  CONFIG.M10_NUM_BYTES 64 \
  CONFIG.M11_NUM_BYTES 64 \
  CONFIG.M12_NUM_BYTES 64 \
  CONFIG.M13_NUM_BYTES 64 \
  CONFIG.M14_NUM_BYTES 64 \
  CONFIG.M15_NUM_BYTES 64 \
  CONFIG.MAX_PAYLD_BYTES 64 \
  CONFIG.M_SEND_PIPELINE 0 \
  CONFIG.NUM_MI 1 \
  CONFIG.NUM_OUTSTANDING 2 \
  CONFIG.NUM_SI 1 \
  CONFIG.PAYLD_WIDTH 148 \
  CONFIG.S00_NUM_BYTES 64 \
  CONFIG.S01_NUM_BYTES 64 \
  CONFIG.S02_NUM_BYTES 64 \
  CONFIG.S03_NUM_BYTES 64 \
  CONFIG.S04_NUM_BYTES 64 \
  CONFIG.S05_NUM_BYTES 64 \
  CONFIG.S06_NUM_BYTES 64 \
  CONFIG.S07_NUM_BYTES 64 \
  CONFIG.S08_NUM_BYTES 64 \
  CONFIG.S09_NUM_BYTES 64 \
  CONFIG.S10_NUM_BYTES 64 \
  CONFIG.S11_NUM_BYTES 64 \
  CONFIG.S12_NUM_BYTES 64 \
  CONFIG.S13_NUM_BYTES 64 \
  CONFIG.S14_NUM_BYTES 64 \
  CONFIG.S15_NUM_BYTES 64 \
  CONFIG.SC_ROUTE_WIDTH 5 \
  CONFIG.S_LATENCY 1 \
  CONFIG.USER_WIDTH 0 \
] [get_bd_cells m04_aw_node]
create_bd_cell -type ip -vlnv xilinx.com:ip:sc_node:1.0 m04_w_node
set_property -dict [list \
  CONFIG.ACLK_RELATIONSHIP 1 \
  CONFIG.ADDR_WIDTH 38 \
  CONFIG.CHANNEL 1 \
  CONFIG.ID_WIDTH 1 \
  CONFIG.M00_NUM_BYTES 64 \
  CONFIG.M01_NUM_BYTES 64 \
  CONFIG.M02_NUM_BYTES 64 \
  CONFIG.M03_NUM_BYTES 64 \
  CONFIG.M04_NUM_BYTES 64 \
  CONFIG.M05_NUM_BYTES 64 \
  CONFIG.M06_NUM_BYTES 64 \
  CONFIG.M07_NUM_BYTES 64 \
  CONFIG.M08_NUM_BYTES 64 \
  CONFIG.M09_NUM_BYTES 64 \
  CONFIG.M10_NUM_BYTES 64 \
  CONFIG.M11_NUM_BYTES 64 \
  CONFIG.M12_NUM_BYTES 64 \
  CONFIG.M13_NUM_BYTES 64 \
  CONFIG.M14_NUM_BYTES 64 \
  CONFIG.M15_NUM_BYTES 64 \
  CONFIG.MAX_PAYLD_BYTES 64 \
  CONFIG.M_SEND_PIPELINE 0 \
  CONFIG.NUM_MI 1 \
  CONFIG.NUM_OUTSTANDING 2 \
  CONFIG.NUM_SI 1 \
  CONFIG.PAYLD_WIDTH 596 \
  CONFIG.S00_NUM_BYTES 64 \
  CONFIG.S01_NUM_BYTES 64 \
  CONFIG.S02_NUM_BYTES 64 \
  CONFIG.S03_NUM_BYTES 64 \
  CONFIG.S04_NUM_BYTES 64 \
  CONFIG.S05_NUM_BYTES 64 \
  CONFIG.S06_NUM_BYTES 64 \
  CONFIG.S07_NUM_BYTES 64 \
  CONFIG.S08_NUM_BYTES 64 \
  CONFIG.S09_NUM_BYTES 64 \
  CONFIG.S10_NUM_BYTES 64 \
  CONFIG.S11_NUM_BYTES 64 \
  CONFIG.S12_NUM_BYTES 64 \
  CONFIG.S13_NUM_BYTES 64 \
  CONFIG.S14_NUM_BYTES 64 \
  CONFIG.S15_NUM_BYTES 64 \
  CONFIG.SC_ROUTE_WIDTH 5 \
  CONFIG.S_LATENCY 1 \
  CONFIG.USER_BITS_PER_BYTE 0 \
  CONFIG.USER_WIDTH 0 \
] [get_bd_cells m04_w_node]
create_bd_cell -type ip -vlnv xilinx.com:ip:sc_node:1.0 m04_b_node
set_property -dict [list \
  CONFIG.ACLK_RELATIONSHIP 1 \
  CONFIG.ADDR_WIDTH 38 \
  CONFIG.CHANNEL 4 \
  CONFIG.ID_WIDTH 1 \
  CONFIG.M00_NUM_BYTES 64 \
  CONFIG.M01_NUM_BYTES 64 \
  CONFIG.M02_NUM_BYTES 64 \
  CONFIG.M03_NUM_BYTES 64 \
  CONFIG.M04_NUM_BYTES 64 \
  CONFIG.M05_NUM_BYTES 64 \
  CONFIG.M06_NUM_BYTES 64 \
  CONFIG.M07_NUM_BYTES 64 \
  CONFIG.M08_NUM_BYTES 64 \
  CONFIG.M09_NUM_BYTES 64 \
  CONFIG.M10_NUM_BYTES 64 \
  CONFIG.M11_NUM_BYTES 64 \
  CONFIG.M12_NUM_BYTES 64 \
  CONFIG.M13_NUM_BYTES 64 \
  CONFIG.M14_NUM_BYTES 64 \
  CONFIG.M15_NUM_BYTES 64 \
  CONFIG.MAX_PAYLD_BYTES 64 \
  CONFIG.M_PIPELINE 0 \
  CONFIG.NUM_MI 1 \
  CONFIG.NUM_OUTSTANDING 2 \
  CONFIG.NUM_SI 1 \
  CONFIG.PAYLD_WIDTH 5 \
  CONFIG.S00_NUM_BYTES 64 \
  CONFIG.S01_NUM_BYTES 64 \
  CONFIG.S02_NUM_BYTES 64 \
  CONFIG.S03_NUM_BYTES 64 \
  CONFIG.S04_NUM_BYTES 64 \
  CONFIG.S05_NUM_BYTES 64 \
  CONFIG.S06_NUM_BYTES 64 \
  CONFIG.S07_NUM_BYTES 64 \
  CONFIG.S08_NUM_BYTES 64 \
  CONFIG.S09_NUM_BYTES 64 \
  CONFIG.S10_NUM_BYTES 64 \
  CONFIG.S11_NUM_BYTES 64 \
  CONFIG.S12_NUM_BYTES 64 \
  CONFIG.S13_NUM_BYTES 64 \
  CONFIG.S14_NUM_BYTES 64 \
  CONFIG.S15_NUM_BYTES 64 \
  CONFIG.SC_ROUTE_WIDTH 1 \
  CONFIG.USER_WIDTH 0 \
] [get_bd_cells m04_b_node]

# ---- hierarchy /m04_exit_pipeline ----
current_bd_instance /m04_exit_pipeline
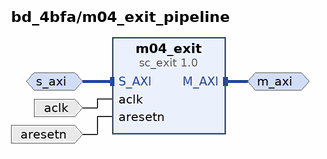
[diagram p14: block diagram inside /m04_exit_pipeline]
create_bd_intf_pin -mode Slave -vlnv xilinx.com:interface:aximm_rtl:1.0 s_axi
create_bd_intf_pin -mode Master -vlnv xilinx.com:interface:aximm_rtl:1.0 m_axi
create_bd_pin -dir I -type clk aclk
create_bd_pin -dir I -type rst aresetn

create_bd_cell -type ip -vlnv xilinx.com:ip:sc_exit:1.0 m04_exit
set_property -dict [list \
  CONFIG.ADDR_WIDTH 38 \
  CONFIG.HAS_BURST 1 \
  CONFIG.IS_CASCADED 1 \
  CONFIG.MAX_RUSER_BITS_PER_BYTE 0 \
  CONFIG.MAX_WUSER_BITS_PER_BYTE 0 \
  CONFIG.MEP_IDENTIFIER_WIDTH 1 \
  CONFIG.M_ARUSER_WIDTH 114 \
  CONFIG.M_AWUSER_WIDTH 114 \
  CONFIG.M_BUSER_WIDTH 114 \
  CONFIG.M_MAX_BURST_LENGTH 16 \
  CONFIG.M_RUSER_BITS_PER_BYTE 0 \
  CONFIG.M_RUSER_WIDTH 14 \
  CONFIG.M_WUSER_BITS_PER_BYTE 0 \
  CONFIG.M_WUSER_WIDTH 14 \
  CONFIG.NUM_MSC 5 \
  CONFIG.NUM_READ_OUTSTANDING 2 \
  CONFIG.NUM_WRITE_OUTSTANDING 2 \
  CONFIG.RDATA_WIDTH 512 \
  CONFIG.READ_WRITE_MODE READ_WRITE \
  CONFIG.SSC000_ROUTE 0b0 \
  CONFIG.SSC001_ROUTE 0b1 \
  CONFIG.SSC_ROUTE_WIDTH 1 \
  CONFIG.S_ID_WIDTH 1 \
  CONFIG.WDATA_WIDTH 512 \
] [get_bd_cells m04_exit]

# ---- connections ----

current_bd_instance /clk_map
connect_bd_net -net clk_map_aclk_net [get_bd_pins aclk] \
  [get_bd_pins S00_ACLK] [get_bd_pins M00_ACLK] [get_bd_pins M01_ACLK] [get_bd_pins M02_ACLK] [get_bd_pins M03_ACLK] \
  [get_bd_pins M04_ACLK] [get_bd_pins swbd_aclk] [get_bd_pins psr_aclk/slowest_sync_clk]
connect_bd_net -net clk_map_aresetn_net [get_bd_pins aresetn] [get_bd_pins psr_aclk/aux_reset_in]
connect_bd_net [get_bd_pins one/dout] [get_bd_pins psr_aclk/ext_reset_in]
connect_bd_net [get_bd_pins psr_aclk/interconnect_aresetn] \
  [get_bd_pins S00_ARESETN] [get_bd_pins M00_ARESETN] [get_bd_pins M01_ARESETN] [get_bd_pins M02_ARESETN] \
  [get_bd_pins M03_ARESETN] [get_bd_pins M04_ARESETN] [get_bd_pins swbd_aresetn]

current_bd_instance /switchboards
connect_bd_intf_net [get_bd_intf_pins S00_SC_AR] [get_bd_intf_pins ar_switchboard/S00_SC]
connect_bd_intf_net [get_bd_intf_pins S00_SC_AW] [get_bd_intf_pins aw_switchboard/S00_SC]
connect_bd_intf_net [get_bd_intf_pins S00_SC_B] [get_bd_intf_pins b_switchboard/S00_SC]
connect_bd_intf_net [get_bd_intf_pins S00_SC_R] [get_bd_intf_pins r_switchboard/S00_SC]
connect_bd_intf_net [get_bd_intf_pins S00_SC_W] [get_bd_intf_pins w_switchboard/S00_SC]
connect_bd_intf_net [get_bd_intf_pins S01_SC_B] [get_bd_intf_pins b_switchboard/S01_SC]
connect_bd_intf_net [get_bd_intf_pins S01_SC_R] [get_bd_intf_pins r_switchboard/S01_SC]
connect_bd_intf_net [get_bd_intf_pins S02_SC_B] [get_bd_intf_pins b_switchboard/S02_SC]
connect_bd_intf_net [get_bd_intf_pins S02_SC_R] [get_bd_intf_pins r_switchboard/S02_SC]
connect_bd_intf_net [get_bd_intf_pins S03_SC_B] [get_bd_intf_pins b_switchboard/S03_SC]
connect_bd_intf_net [get_bd_intf_pins S03_SC_R] [get_bd_intf_pins r_switchboard/S03_SC]
connect_bd_intf_net [get_bd_intf_pins S04_SC_B] [get_bd_intf_pins b_switchboard/S04_SC]
connect_bd_intf_net [get_bd_intf_pins S04_SC_R] [get_bd_intf_pins r_switchboard/S04_SC]
connect_bd_intf_net [get_bd_intf_pins M00_SC_AR] [get_bd_intf_pins ar_switchboard/M00_SC]
connect_bd_intf_net [get_bd_intf_pins M01_SC_AR] [get_bd_intf_pins ar_switchboard/M01_SC]
connect_bd_intf_net [get_bd_intf_pins M02_SC_AR] [get_bd_intf_pins ar_switchboard/M02_SC]
connect_bd_intf_net [get_bd_intf_pins M03_SC_AR] [get_bd_intf_pins ar_switchboard/M03_SC]
connect_bd_intf_net [get_bd_intf_pins M04_SC_AR] [get_bd_intf_pins ar_switchboard/M04_SC]
connect_bd_intf_net [get_bd_intf_pins M00_SC_AW] [get_bd_intf_pins aw_switchboard/M00_SC]
connect_bd_intf_net [get_bd_intf_pins M01_SC_AW] [get_bd_intf_pins aw_switchboard/M01_SC]
connect_bd_intf_net [get_bd_intf_pins M02_SC_AW] [get_bd_intf_pins aw_switchboard/M02_SC]
connect_bd_intf_net [get_bd_intf_pins M03_SC_AW] [get_bd_intf_pins aw_switchboard/M03_SC]
connect_bd_intf_net [get_bd_intf_pins M04_SC_AW] [get_bd_intf_pins aw_switchboard/M04_SC]
connect_bd_intf_net [get_bd_intf_pins M00_SC_B] [get_bd_intf_pins b_switchboard/M00_SC]
connect_bd_intf_net [get_bd_intf_pins M00_SC_R] [get_bd_intf_pins r_switchboard/M00_SC]
connect_bd_intf_net [get_bd_intf_pins M00_SC_W] [get_bd_intf_pins w_switchboard/M00_SC]
connect_bd_intf_net [get_bd_intf_pins M01_SC_W] [get_bd_intf_pins w_switchboard/M01_SC]
connect_bd_intf_net [get_bd_intf_pins M02_SC_W] [get_bd_intf_pins w_switchboard/M02_SC]
connect_bd_intf_net [get_bd_intf_pins M03_SC_W] [get_bd_intf_pins w_switchboard/M03_SC]
connect_bd_intf_net [get_bd_intf_pins M04_SC_W] [get_bd_intf_pins w_switchboard/M04_SC]
connect_bd_net [get_bd_pins aclk] \
  [get_bd_pins ar_switchboard/aclk] [get_bd_pins aw_switchboard/aclk] [get_bd_pins b_switchboard/aclk] \
  [get_bd_pins r_switchboard/aclk] [get_bd_pins w_switchboard/aclk]

current_bd_instance /s00_entry_pipeline
connect_bd_intf_net [get_bd_intf_pins s00_mmu/M_AXI] [get_bd_intf_pins s00_transaction_regulator/S_AXI]
connect_bd_intf_net [get_bd_intf_pins m_axi] [get_bd_intf_pins s00_si_converter/M_AXI]
connect_bd_intf_net [get_bd_intf_pins s00_transaction_regulator/M_AXI] [get_bd_intf_pins s00_si_converter/S_AXI]
connect_bd_intf_net [get_bd_intf_pins s_axi] [get_bd_intf_pins s00_mmu/S_AXI]
connect_bd_net [get_bd_pins aclk] [get_bd_pins s00_mmu/aclk] [get_bd_pins s00_si_converter/aclk] [get_bd_pins s00_transaction_regulator/aclk]
connect_bd_net [get_bd_pins aresetn] \
  [get_bd_pins s00_mmu/aresetn] [get_bd_pins s00_si_converter/aresetn] [get_bd_pins s00_transaction_regulator/aresetn]

current_bd_instance /s00_nodes
connect_bd_intf_net [get_bd_intf_pins S_SC_AR] [get_bd_intf_pins s00_ar_node/S_SC]
connect_bd_intf_net [get_bd_intf_pins S_SC_AW] [get_bd_intf_pins s00_aw_node/S_SC]
connect_bd_intf_net [get_bd_intf_pins S_SC_B] [get_bd_intf_pins s00_b_node/S_SC]
connect_bd_intf_net [get_bd_intf_pins S_SC_R] [get_bd_intf_pins s00_r_node/S_SC]
connect_bd_intf_net [get_bd_intf_pins S_SC_W] [get_bd_intf_pins s00_w_node/S_SC]
connect_bd_intf_net [get_bd_intf_pins M_SC_AR] [get_bd_intf_pins s00_ar_node/M_SC]
connect_bd_intf_net [get_bd_intf_pins M_SC_AW] [get_bd_intf_pins s00_aw_node/M_SC]
connect_bd_intf_net [get_bd_intf_pins M_SC_B] [get_bd_intf_pins s00_b_node/M_SC]
connect_bd_intf_net [get_bd_intf_pins M_SC_R] [get_bd_intf_pins s00_r_node/M_SC]
connect_bd_intf_net [get_bd_intf_pins M_SC_W] [get_bd_intf_pins s00_w_node/M_SC]
connect_bd_net [get_bd_pins m_sc_clk] \
  [get_bd_pins s00_ar_node/m_sc_aclk] [get_bd_pins s00_aw_node/m_sc_aclk] [get_bd_pins s00_w_node/m_sc_aclk] \
  [get_bd_pins s00_r_node/s_sc_aclk] [get_bd_pins s00_b_node/s_sc_aclk]
connect_bd_net [get_bd_pins m_sc_resetn] \
  [get_bd_pins s00_ar_node/m_sc_aresetn] [get_bd_pins s00_aw_node/m_sc_aresetn] [get_bd_pins s00_w_node/m_sc_aresetn] \
  [get_bd_pins s00_r_node/s_sc_aresetn] [get_bd_pins s00_b_node/s_sc_aresetn]
connect_bd_net [get_bd_pins s_sc_clk] \
  [get_bd_pins s00_ar_node/s_sc_aclk] [get_bd_pins s00_aw_node/s_sc_aclk] [get_bd_pins s00_w_node/s_sc_aclk] \
  [get_bd_pins s00_r_node/m_sc_aclk] [get_bd_pins s00_b_node/m_sc_aclk]
connect_bd_net [get_bd_pins s_sc_resetn] \
  [get_bd_pins s00_ar_node/s_sc_aresetn] [get_bd_pins s00_aw_node/s_sc_aresetn] [get_bd_pins s00_w_node/s_sc_aresetn] \
  [get_bd_pins s00_r_node/m_sc_aresetn] [get_bd_pins s00_b_node/m_sc_aresetn]

current_bd_instance /m00_nodes
connect_bd_intf_net [get_bd_intf_pins S_SC_AR] [get_bd_intf_pins m00_ar_node/S_SC]
connect_bd_intf_net [get_bd_intf_pins S_SC_AW] [get_bd_intf_pins m00_aw_node/S_SC]
connect_bd_intf_net [get_bd_intf_pins S_SC_B] [get_bd_intf_pins m00_b_node/S_SC]
connect_bd_intf_net [get_bd_intf_pins S_SC_R] [get_bd_intf_pins m00_r_node/S_SC]
connect_bd_intf_net [get_bd_intf_pins S_SC_W] [get_bd_intf_pins m00_w_node/S_SC]
connect_bd_intf_net [get_bd_intf_pins M_SC_AR] [get_bd_intf_pins m00_ar_node/M_SC]
connect_bd_intf_net [get_bd_intf_pins M_SC_AW] [get_bd_intf_pins m00_aw_node/M_SC]
connect_bd_intf_net [get_bd_intf_pins M_SC_B] [get_bd_intf_pins m00_b_node/M_SC]
connect_bd_intf_net [get_bd_intf_pins M_SC_R] [get_bd_intf_pins m00_r_node/M_SC]
connect_bd_intf_net [get_bd_intf_pins M_SC_W] [get_bd_intf_pins m00_w_node/M_SC]
connect_bd_net [get_bd_pins m_axi_aclk] \
  [get_bd_pins m00_ar_node/m_sc_aclk] [get_bd_pins m00_aw_node/m_sc_aclk] [get_bd_pins m00_w_node/m_sc_aclk] \
  [get_bd_pins m00_r_node/s_sc_aclk] [get_bd_pins m00_b_node/s_sc_aclk]
connect_bd_net [get_bd_pins m_axi_aresetn] \
  [get_bd_pins m00_ar_node/m_sc_aresetn] [get_bd_pins m00_aw_node/m_sc_aresetn] [get_bd_pins m00_w_node/m_sc_aresetn] \
  [get_bd_pins m00_r_node/s_sc_aresetn] [get_bd_pins m00_b_node/s_sc_aresetn]
connect_bd_net [get_bd_pins s_axi_aclk] \
  [get_bd_pins m00_ar_node/s_sc_aclk] [get_bd_pins m00_aw_node/s_sc_aclk] [get_bd_pins m00_w_node/s_sc_aclk] \
  [get_bd_pins m00_r_node/m_sc_aclk] [get_bd_pins m00_b_node/m_sc_aclk]
connect_bd_net [get_bd_pins s_axi_aresetn] \
  [get_bd_pins m00_ar_node/s_sc_aresetn] [get_bd_pins m00_aw_node/s_sc_aresetn] [get_bd_pins m00_w_node/s_sc_aresetn] \
  [get_bd_pins m00_r_node/m_sc_aresetn] [get_bd_pins m00_b_node/m_sc_aresetn]

current_bd_instance /m00_exit_pipeline
connect_bd_intf_net [get_bd_intf_pins m_axi] [get_bd_intf_pins m00_exit/M_AXI]
connect_bd_intf_net [get_bd_intf_pins s_axi] [get_bd_intf_pins m00_exit/S_AXI]
connect_bd_net [get_bd_pins aclk] [get_bd_pins m00_exit/aclk]
connect_bd_net [get_bd_pins aresetn] [get_bd_pins m00_exit/aresetn]

current_bd_instance /m01_nodes
connect_bd_intf_net [get_bd_intf_pins S_SC_AR] [get_bd_intf_pins m01_ar_node/S_SC]
connect_bd_intf_net [get_bd_intf_pins S_SC_AW] [get_bd_intf_pins m01_aw_node/S_SC]
connect_bd_intf_net [get_bd_intf_pins S_SC_B] [get_bd_intf_pins m01_b_node/S_SC]
connect_bd_intf_net [get_bd_intf_pins S_SC_R] [get_bd_intf_pins m01_r_node/S_SC]
connect_bd_intf_net [get_bd_intf_pins S_SC_W] [get_bd_intf_pins m01_w_node/S_SC]
connect_bd_intf_net [get_bd_intf_pins M_SC_AR] [get_bd_intf_pins m01_ar_node/M_SC]
connect_bd_intf_net [get_bd_intf_pins M_SC_AW] [get_bd_intf_pins m01_aw_node/M_SC]
connect_bd_intf_net [get_bd_intf_pins M_SC_B] [get_bd_intf_pins m01_b_node/M_SC]
connect_bd_intf_net [get_bd_intf_pins M_SC_R] [get_bd_intf_pins m01_r_node/M_SC]
connect_bd_intf_net [get_bd_intf_pins M_SC_W] [get_bd_intf_pins m01_w_node/M_SC]
connect_bd_net [get_bd_pins m_axi_aclk] \
  [get_bd_pins m01_ar_node/m_sc_aclk] [get_bd_pins m01_aw_node/m_sc_aclk] [get_bd_pins m01_w_node/m_sc_aclk] \
  [get_bd_pins m01_r_node/s_sc_aclk] [get_bd_pins m01_b_node/s_sc_aclk]
connect_bd_net [get_bd_pins m_axi_aresetn] \
  [get_bd_pins m01_ar_node/m_sc_aresetn] [get_bd_pins m01_aw_node/m_sc_aresetn] [get_bd_pins m01_w_node/m_sc_aresetn] \
  [get_bd_pins m01_r_node/s_sc_aresetn] [get_bd_pins m01_b_node/s_sc_aresetn]
connect_bd_net [get_bd_pins s_axi_aclk] \
  [get_bd_pins m01_ar_node/s_sc_aclk] [get_bd_pins m01_aw_node/s_sc_aclk] [get_bd_pins m01_w_node/s_sc_aclk] \
  [get_bd_pins m01_r_node/m_sc_aclk] [get_bd_pins m01_b_node/m_sc_aclk]
connect_bd_net [get_bd_pins s_axi_aresetn] \
  [get_bd_pins m01_ar_node/s_sc_aresetn] [get_bd_pins m01_aw_node/s_sc_aresetn] [get_bd_pins m01_w_node/s_sc_aresetn] \
  [get_bd_pins m01_r_node/m_sc_aresetn] [get_bd_pins m01_b_node/m_sc_aresetn]

current_bd_instance /m01_exit_pipeline
connect_bd_intf_net [get_bd_intf_pins m_axi] [get_bd_intf_pins m01_exit/M_AXI]
connect_bd_intf_net [get_bd_intf_pins s_axi] [get_bd_intf_pins m01_exit/S_AXI]
connect_bd_net [get_bd_pins aclk] [get_bd_pins m01_exit/aclk]
connect_bd_net [get_bd_pins aresetn] [get_bd_pins m01_exit/aresetn]

current_bd_instance /m02_nodes
connect_bd_intf_net [get_bd_intf_pins S_SC_AR] [get_bd_intf_pins m02_ar_node/S_SC]
connect_bd_intf_net [get_bd_intf_pins S_SC_AW] [get_bd_intf_pins m02_aw_node/S_SC]
connect_bd_intf_net [get_bd_intf_pins S_SC_B] [get_bd_intf_pins m02_b_node/S_SC]
connect_bd_intf_net [get_bd_intf_pins S_SC_R] [get_bd_intf_pins m02_r_node/S_SC]
connect_bd_intf_net [get_bd_intf_pins S_SC_W] [get_bd_intf_pins m02_w_node/S_SC]
connect_bd_intf_net [get_bd_intf_pins M_SC_AR] [get_bd_intf_pins m02_ar_node/M_SC]
connect_bd_intf_net [get_bd_intf_pins M_SC_AW] [get_bd_intf_pins m02_aw_node/M_SC]
connect_bd_intf_net [get_bd_intf_pins M_SC_B] [get_bd_intf_pins m02_b_node/M_SC]
connect_bd_intf_net [get_bd_intf_pins M_SC_R] [get_bd_intf_pins m02_r_node/M_SC]
connect_bd_intf_net [get_bd_intf_pins M_SC_W] [get_bd_intf_pins m02_w_node/M_SC]
connect_bd_net [get_bd_pins m_axi_aclk] \
  [get_bd_pins m02_ar_node/m_sc_aclk] [get_bd_pins m02_aw_node/m_sc_aclk] [get_bd_pins m02_w_node/m_sc_aclk] \
  [get_bd_pins m02_r_node/s_sc_aclk] [get_bd_pins m02_b_node/s_sc_aclk]
connect_bd_net [get_bd_pins m_axi_aresetn] \
  [get_bd_pins m02_ar_node/m_sc_aresetn] [get_bd_pins m02_aw_node/m_sc_aresetn] [get_bd_pins m02_w_node/m_sc_aresetn] \
  [get_bd_pins m02_r_node/s_sc_aresetn] [get_bd_pins m02_b_node/s_sc_aresetn]
connect_bd_net [get_bd_pins s_axi_aclk] \
  [get_bd_pins m02_ar_node/s_sc_aclk] [get_bd_pins m02_aw_node/s_sc_aclk] [get_bd_pins m02_w_node/s_sc_aclk] \
  [get_bd_pins m02_r_node/m_sc_aclk] [get_bd_pins m02_b_node/m_sc_aclk]
connect_bd_net [get_bd_pins s_axi_aresetn] \
  [get_bd_pins m02_ar_node/s_sc_aresetn] [get_bd_pins m02_aw_node/s_sc_aresetn] [get_bd_pins m02_w_node/s_sc_aresetn] \
  [get_bd_pins m02_r_node/m_sc_aresetn] [get_bd_pins m02_b_node/m_sc_aresetn]

current_bd_instance /m02_exit_pipeline
connect_bd_intf_net [get_bd_intf_pins m_axi] [get_bd_intf_pins m02_exit/M_AXI]
connect_bd_intf_net [get_bd_intf_pins s_axi] [get_bd_intf_pins m02_exit/S_AXI]
connect_bd_net [get_bd_pins aclk] [get_bd_pins m02_exit/aclk]
connect_bd_net [get_bd_pins aresetn] [get_bd_pins m02_exit/aresetn]

current_bd_instance /m03_nodes
connect_bd_intf_net [get_bd_intf_pins S_SC_AR] [get_bd_intf_pins m03_ar_node/S_SC]
connect_bd_intf_net [get_bd_intf_pins S_SC_AW] [get_bd_intf_pins m03_aw_node/S_SC]
connect_bd_intf_net [get_bd_intf_pins S_SC_B] [get_bd_intf_pins m03_b_node/S_SC]
connect_bd_intf_net [get_bd_intf_pins S_SC_R] [get_bd_intf_pins m03_r_node/S_SC]
connect_bd_intf_net [get_bd_intf_pins S_SC_W] [get_bd_intf_pins m03_w_node/S_SC]
connect_bd_intf_net [get_bd_intf_pins M_SC_AR] [get_bd_intf_pins m03_ar_node/M_SC]
connect_bd_intf_net [get_bd_intf_pins M_SC_AW] [get_bd_intf_pins m03_aw_node/M_SC]
connect_bd_intf_net [get_bd_intf_pins M_SC_B] [get_bd_intf_pins m03_b_node/M_SC]
connect_bd_intf_net [get_bd_intf_pins M_SC_R] [get_bd_intf_pins m03_r_node/M_SC]
connect_bd_intf_net [get_bd_intf_pins M_SC_W] [get_bd_intf_pins m03_w_node/M_SC]
connect_bd_net [get_bd_pins m_axi_aclk] \
  [get_bd_pins m03_ar_node/m_sc_aclk] [get_bd_pins m03_aw_node/m_sc_aclk] [get_bd_pins m03_w_node/m_sc_aclk] \
  [get_bd_pins m03_r_node/s_sc_aclk] [get_bd_pins m03_b_node/s_sc_aclk]
connect_bd_net [get_bd_pins m_axi_aresetn] \
  [get_bd_pins m03_ar_node/m_sc_aresetn] [get_bd_pins m03_aw_node/m_sc_aresetn] [get_bd_pins m03_w_node/m_sc_aresetn] \
  [get_bd_pins m03_r_node/s_sc_aresetn] [get_bd_pins m03_b_node/s_sc_aresetn]
connect_bd_net [get_bd_pins s_axi_aclk] \
  [get_bd_pins m03_ar_node/s_sc_aclk] [get_bd_pins m03_aw_node/s_sc_aclk] [get_bd_pins m03_w_node/s_sc_aclk] \
  [get_bd_pins m03_r_node/m_sc_aclk] [get_bd_pins m03_b_node/m_sc_aclk]
connect_bd_net [get_bd_pins s_axi_aresetn] \
  [get_bd_pins m03_ar_node/s_sc_aresetn] [get_bd_pins m03_aw_node/s_sc_aresetn] [get_bd_pins m03_w_node/s_sc_aresetn] \
  [get_bd_pins m03_r_node/m_sc_aresetn] [get_bd_pins m03_b_node/m_sc_aresetn]
